# EAGLE design GPIO-Adapter_v11 (EAGLE 7.7.0)
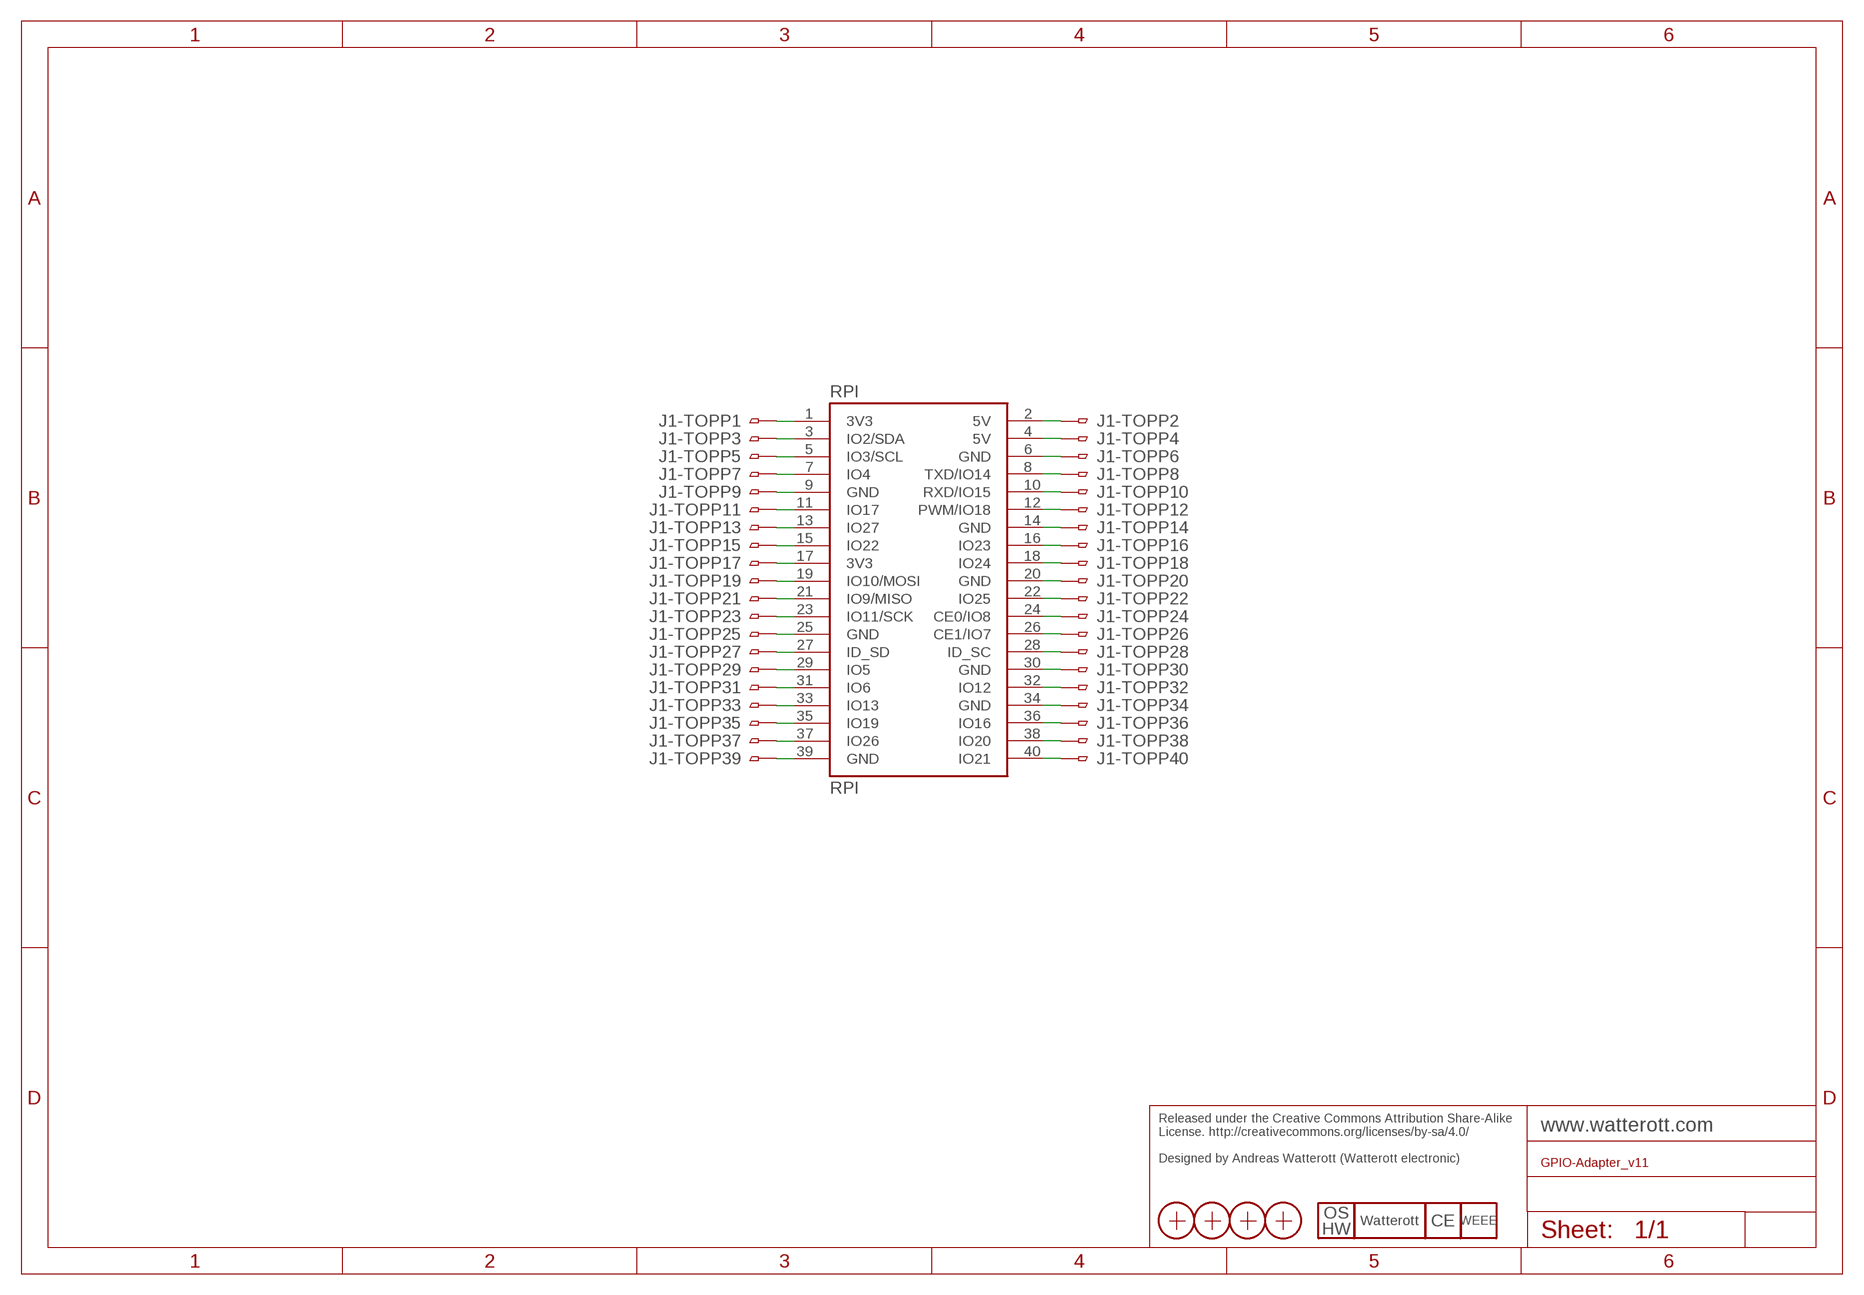
[diagram p0: schematic, sheet 1]

## Parts
J1-TOP  FPC40_PIN  [FPC40-0.5]
LOGO2  LOGO_OSHW-4  [OSHW_4MM]
LOGO3  LOGO_SPARK-4  [SPARK_4MM]
LOGO4  LOGO_CE-2  [CE_2MM]
LOGO5  LOGO_WEEE-4  [WEEE_4MM]
RPI  RPI  RPI_B+-CONTOP  [RPI-B+_CON_TOP]
X1  PASSER  [PASSER]
X2  PASSER  [PASSER]
X3  PASSER  [PASSER]
X4  PASSER  [PASSER]

## Nets
1: J1-TOP.1 RPI.1(3V3)
2: J1-TOP.2 RPI.2(5V)
3: J1-TOP.3 RPI.3(IO2/SDA)
4: J1-TOP.4 RPI.4(5V)
5: J1-TOP.5 RPI.5(IO3/SCL)
6: J1-TOP.6 RPI.6(GND)
7: J1-TOP.7 RPI.7(IO4)
8: J1-TOP.8 RPI.8(TXD/IO14)
9: J1-TOP.9 RPI.9(GND)
10: J1-TOP.10 RPI.10(RXD/IO15)
11: J1-TOP.11 RPI.11(IO17)
12: J1-TOP.12 RPI.12(PWM/IO18)
13: J1-TOP.13 RPI.13(IO27)
14: J1-TOP.14 RPI.14(GND)
15: J1-TOP.15 RPI.15(IO22)
16: J1-TOP.16 RPI.16(IO23)
17: J1-TOP.17 RPI.17(3V3)
18: J1-TOP.18 RPI.18(IO24)
19: J1-TOP.19 RPI.19(IO10/MOSI)
20: J1-TOP.20 RPI.20(GND)
21: J1-TOP.21 RPI.21(IO9/MISO)
22: J1-TOP.22 RPI.22(IO25)
23: J1-TOP.23 RPI.23(IO11/SCK)
24: J1-TOP.24 RPI.24(CE0/IO8)
25: J1-TOP.25 RPI.25(GND)
26: J1-TOP.26 RPI.26(CE1/IO7)
27: J1-TOP.27 RPI.27(ID_SD)
28: J1-TOP.28 RPI.28(ID_SC)
29: J1-TOP.29 RPI.29(IO5)
30: J1-TOP.30 RPI.30(GND)
31: J1-TOP.31 RPI.31(IO6)
32: J1-TOP.32 RPI.32(IO12)
33: J1-TOP.33 RPI.33(IO13)
34: J1-TOP.34 RPI.34(GND)
35: J1-TOP.35 RPI.35(IO19)
36: J1-TOP.36 RPI.36(IO16)
37: J1-TOP.37 RPI.37(IO26)
38: J1-TOP.38 RPI.38(IO20)
39: J1-TOP.39 RPI.39(GND)
40: J1-TOP.40 RPI.40(IO21)

## Notes on the sheet
- Released under the Creative Commons Attribution Share-Alike 
  License. http://creativecommons.org/licenses/by-sa/4.0/
  
  Designed by Andreas Watterott (Watterott electronic)

## Library data of the parts
J1-TOP = we-con:FPC40_PIN: FPC/ZIF Connector FCI 62684-402100AHLF -> 40 Pins 0.5mm top contact FCI 62684-401100AHLF -> 40 Pins 0.5mm bottom contact; DIGIKEY_BOT: 62684-401100AHLF-ND; DIGIKEY_TOP: 62684-402100AHLF-ND
LOGO2 = we-symbol:LOGO_OSHW: Open-Source-Hardware Logo
LOGO3 = we-symbol:LOGO_SPARK: Watterott electronic Logo
LOGO4 = we-symbol:LOGO_CE: CE Logo
LOGO5 = we-symbol:LOGO_WEEE: WEEE Logo
RPI = we-board:RPI_B+: Raspberry Pi 1 B+ / Pi 2 / Pi 3 / Pi Zero
X1-X4 = SMD:PASSER

## Board
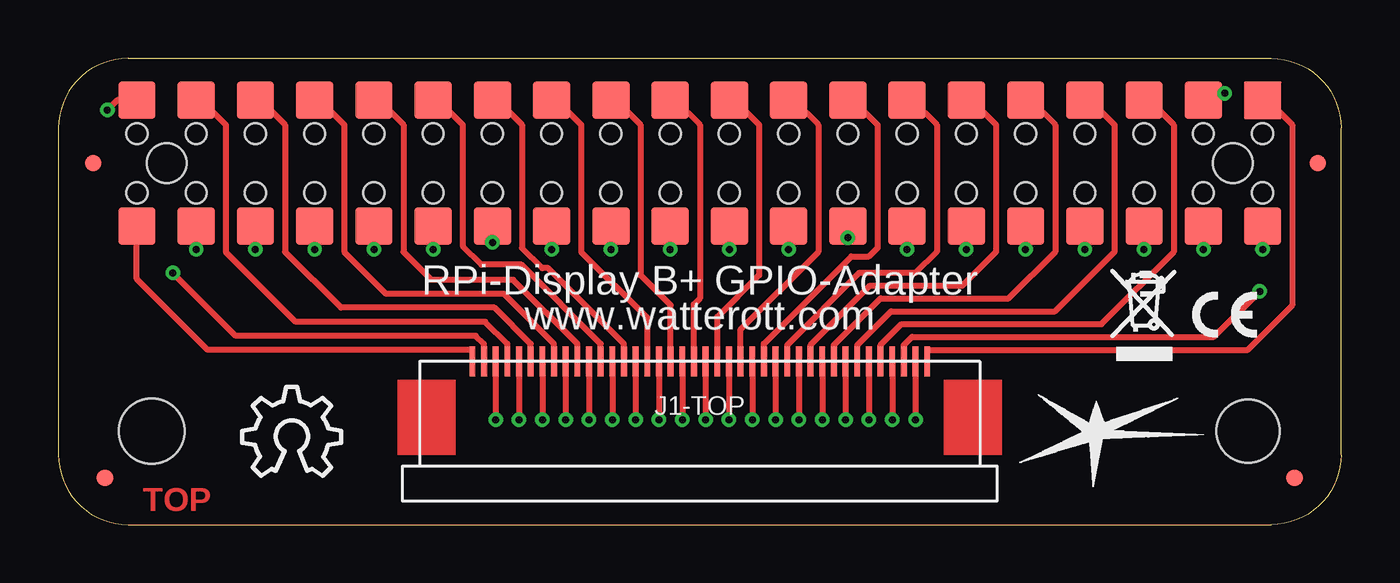
[diagram p1: board, top side]
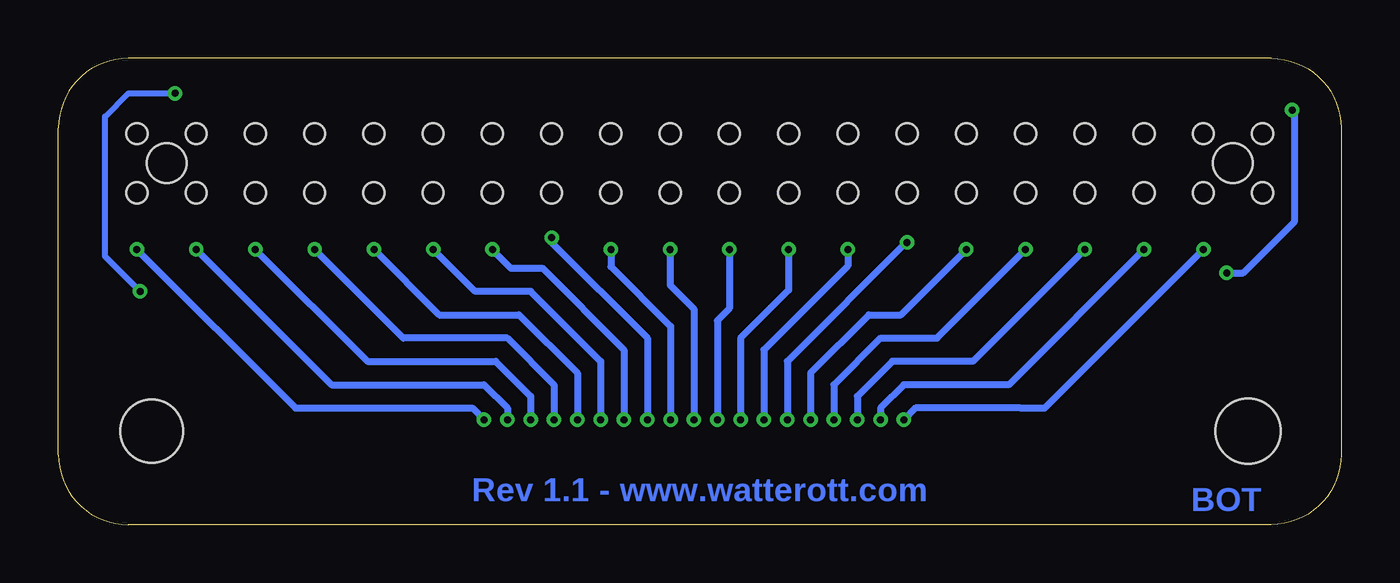
[diagram p2: board, bottom side, seen from below]

Size 55 x 20 mm. Coordinates in mm from the lower left corner, seen from the top.
Outline: 3,0 52,0 arc90 55,3 55,17 arc90 52,20 3,20 arc90 0,17 0,3 arc90 3,0
Copper layers (1*16): Top 0.035mm / dielectric 1.5mm / Bottom 0.035mm
Design rules "we-dru-2-layer *": minimum track width 0.18mm, minimum drill 0.3mm, track to track 0.18mm, track to pad 0.18mm, pad to pad 0.18mm, via to via 0.18mm, smd to smd 0mil, copper to edge 0.4mm, drill to drill 0.2mm, minimum pad ring 0.18mm, minimum via ring 0.16mm, stop-mask expansion 0.1mm, vias tented up to drill 0.5mm, thermal gap 0.25mm
Holes 2.7 mm at 51,4
Holes 2.8 mm at 4,4

### Footprints (pad centres in the part's own frame; a part is rotated, then mirrored left to right if it is on the bottom)
FPC40-0.5 = smd 1.27 x 0.279: 1 0,9.75; 2 0,9.25; 3 0,8.75; 4 0,8.25; 5 0,7.75; 6 0,7.25; 7 0,6.75; 8 0,6.25; 9 0,5.75; 10 0,5.25; 11 0,4.75; 12 0,4.25; 13 0,3.75; 14 0,3.25; 15 0,2.75; 16 0,2.25; 17 0,1.75; 18 0,1.25; 19 0,0.75; 20 0,0.25; 21 0,-0.25; 22 0,-0.75; 23 0,-1.25; 24 0,-1.75; 25 0,-2.25; 26 0,-2.75; 27 0,-3.25; 28 0,-3.75; 29 0,-4.25; 30 0,-4.75; 31 0,-5.25; 32 0,-5.75; 33 0,-6.25; 34 0,-6.75; 35 0,-7.25; 36 0,-7.75; 37 0,-8.25; 38 0,-8.75; 39 0,-9.25; 40 0,-9.75
RPI-B+_CON_TOP = smd 1.6 x 1.6: 1 -24.13,-2.7; 2 -24.13,2.7; 3 -21.59,-2.7; 4 -21.59,2.7; 5 -19.05,-2.7; 6 -19.05,2.7; 7 -16.51,-2.7; 8 -16.51,2.7; 9 -13.97,-2.7; 10 -13.97,2.7; 11 -11.43,-2.7; 12 -11.43,2.7; 13 -8.89,-2.7; 14 -8.89,2.7; 15 -6.35,-2.7; 16 -6.35,2.7; 17 -3.81,-2.7; 18 -3.81,2.7; 19 -1.27,-2.7; 20 -1.27,2.7; 21 1.27,-2.7; 22 1.27,2.7; 23 3.81,-2.7; 24 3.81,2.7; 25 6.35,-2.7; 26 6.35,2.7; 27 8.89,-2.7; 28 8.89,2.7; 29 11.43,-2.7; 30 11.43,2.7; 31 13.97,-2.7; 32 13.97,2.7; 33 16.51,-2.7; 34 16.51,2.7; 35 19.05,-2.7; 36 19.05,2.7; 37 21.59,-2.7; 38 21.59,2.7; 39 24.13,-2.7; 40 24.13,2.7 | hole 0.9: 24.13,1.27; 21.59,1.27; 19.05,1.27; 16.51,1.27; 13.97,1.27; 11.43,1.27; 8.89,1.27; 6.35,1.27; 3.81,1.27; 1.27,1.27; -1.27,1.27; -3.81,1.27; -6.35,1.27; -8.89,1.27; -11.43,1.27; -13.97,1.27; -16.51,1.27; -19.05,1.27; -21.59,1.27; -24.13,1.27; -24.13,-1.27; -21.59,-1.27; -19.05,-1.27; -16.51,-1.27; -13.97,-1.27; -11.43,-1.27; -8.89,-1.27; -6.35,-1.27; -3.81,-1.27; -1.27,-1.27; 1.27,-1.27; 3.81,-1.27; 6.35,-1.27; 8.89,-1.27; 11.43,-1.27; 13.97,-1.27; 16.51,-1.27; 19.05,-1.27; 21.59,-1.27; 24.13,-1.27 | hole 1.7: -22.86,0; 22.86,0
PASSER = smd 0.7 x 0.7: X 0,0

### Placement (x,y rotation side)
J1-TOP  27.5,7 270 top
LOGO2  10,4 0 top
LOGO3  44.5,4 0 top
LOGO4  50,9 0 top
LOGO5  46.5,9 0 top
RPI  27.5,15.5 180 top
X1  2,2 0 top
X2  1.5,15.5 0 top
X3  54,15.5 0 top
X4  53,2 0 top

### Tracks (layer width: path | path; a pad name or v marks a point on that pad's centre or on a via)
1
  Top 0.254: J1-TOP.1 37.25,7.5 51,7.5 52.9,9.4 52.9,17.14 51.84,18.2 RPI.1
2  (via drill 0.3)
  Top 0.254: J1-TOP.2 v36.75,4.5 | RPI.2 v51.63,11.8
  Bottom 0.305: v36.75,4.5 37.25,5 44.83,5 v51.63,11.8
3  (via drill 0.3)
  Top 0.254: J1-TOP.3 36.25,7.7 36.6,8.05 49.55,8.05 v51.5,10 | v50,18.5 49.39,18.5 RPI.3
  Bottom 0.254: v51.5,10 53,11.5 53,17.5 52,18.5 v50,18.5
4  (via drill 0.3)
  Top 0.254: J1-TOP.4 v35.75,4.5 | RPI.4 v49.09,11.8
  Bottom 0.305: v35.75,4.5 35.75,5 36.75,6 43.29,6 v49.09,11.8
5
  Top 0.254: J1-TOP.5 35.25,7.7 36.15,8.6 44.72,8.6 47.82,11.7 47.82,17.14 46.77,18.2 RPI.5
6  (via drill 0.3)
  Top 0.254: J1-TOP.6 v34.75,4.5 | RPI.6 v46.55,11.8
  Bottom 0.305: v34.75,4.5 34.75,5.5 36.25,7 41.75,7 v46.55,11.8
7
  Top 0.254: J1-TOP.7 34.25,7.7 35.7,9.15 42.73,9.15 45.28,11.7 45.28,17.14 44.23,18.2 RPI.7
8  (via drill 0.3)
  Top 0.254: J1-TOP.8 v33.75,4.5 | RPI.8 v44.01,11.8
  Bottom 0.305: v33.75,4.5 33.75,6 35.75,8 40.21,8 v44.01,11.8
9
  Top 0.254: J1-TOP.9 33.25,7.7 35.25,9.7 40.74,9.7 42.74,11.7 42.74,17.14 41.69,18.2 RPI.9
10  (via drill 0.3)
  Top 0.254: J1-TOP.10 v32.75,4.5 | RPI.10 v41.47,11.8
  Bottom 0.305: v32.75,4.5 32.75,6.5 35.25,9 38.67,9 v41.47,11.8
11
  Top 0.254: J1-TOP.11 32.25,7.7 34.8,10.25 38.75,10.25 40.2,11.7 40.2,17.14 39.14,18.2 RPI.11
12  (via drill 0.3)
  Top 0.254: J1-TOP.12 v31.75,4.5 | RPI.12 v38.93,11.8
  Bottom 0.305: v31.75,4.5 J1-TOP.12 34.75,10 37.13,10 v38.93,11.8
13
  Top 0.254: J1-TOP.13 31.25,7.7 34.35,10.8 36.76,10.8 37.66,11.7 37.66,17.14 36.61,18.2 RPI.13
14  (via drill 0.3)
  Top 0.254: J1-TOP.14 v30.75,4.5 | RPI.14 v36.39,11.8
  Bottom 0.254: v36.4,11.8 v36.39,11.8
  Bottom 0.305: v30.75,4.5 30.75,7.5 34.25,11 35.6,11 v36.4,11.8
15
  Top 0.254: J1-TOP.15 30.25,7.75 34,11.5 34.75,11.5 35.12,11.87 35.12,17.14 34.06,18.2 RPI.15
16  (via drill 0.3)
  Top 0.254: J1-TOP.16 v29.75,4.5 | RPI.16 v33.85,12.3
  Bottom 0.305: v29.75,4.5 29.75,8 33.85,12.1 v33.85,12.3
17
  Top 0.254: J1-TOP.17 29.25,8.37 32.58,11.7 32.58,17.14 31.52,18.2 RPI.17
18  (via drill 0.3)
  Top 0.254: J1-TOP.18 v28.75,4.5 | RPI.18 v31.31,11.8
  Bottom 0.305: v28.75,4.5 28.75,8.5 31.31,11.06 v31.31,11.8
19
  Top 0.254: J1-TOP.19 28.25,8.91 30.04,10.7 30.04,17.14 28.98,18.2 RPI.19
20  (via drill 0.3)
  Top 0.254: J1-TOP.20 v27.75,4.5 | RPI.20 v28.77,11.8
  Bottom 0.305: v27.75,4.5 27.75,9.25 28.77,10.27 v28.77,11.8
21
  Top 0.254: J1-TOP.21 27.25,9.45 27.5,9.7 27.5,17.14 26.45,18.2 RPI.21
22  (via drill 0.3)
  Top 0.254: J1-TOP.22 v26.75,4.5 | RPI.22 v26.23,11.8
  Bottom 0.305: v26.75,4.5 26.75,8.75 26.23,9.27 v26.23,11.8
23
  Top 0.254: J1-TOP.23 26.25,9.41 24.96,10.7 24.96,17.14 23.91,18.2 RPI.23
24  (via drill 0.3)
  Top 0.254: J1-TOP.24 v25.75,4.5 | RPI.24 v23.69,11.8
  Bottom 0.305: v25.75,4.5 25.75,8 23.69,10.06 v23.69,11.8
25
  Top 0.254: J1-TOP.25 25.25,8.87 22.42,11.7 22.42,17.14 21.37,18.2 RPI.25
26  (via drill 0.3)
  Top 0.254: J1-TOP.26 v24.75,4.5 | RPI.26 v21.15,11.8
  Bottom 0.305: v24.75,4.5 24.75,7.5 21.15,11.1 v21.15,11.8
27
  Top 0.254: RPI.27 18.82,18.2 19.88,17.14 19.88,11.87 20.75,11 21,11 24.25,7.75 J1-TOP.27
28  (via drill 0.3)
  Top 0.254: J1-TOP.28 v23.75,4.5 | RPI.28 v18.61,12.1
  Bottom 0.305: v23.75,4.5 J1-TOP.28 18.61,12.14 v18.61,12.1
29
  Top 0.254: J1-TOP.29 23.25,7.75 19.85,11.15 18.14,11.15 17.34,11.95 17.34,17.14 16.29,18.2 RPI.29
30  (via drill 0.3)
  Top 0.254: J1-TOP.30 v22.75,4.5 | RPI.30 v16.07,11.8
  Bottom 0.305: v22.75,4.5 22.75,6.5 20.25,9 18.87,9 v16.07,11.8
31
  Top 0.254: J1-TOP.31 22.25,7.75 19.5,10.5 16,10.5 14.8,11.7 14.8,17.14 13.74,18.2 RPI.31
32  (via drill 0.3)
  Top 0.254: J1-TOP.32 v21.75,4.5 | RPI.32 v13.53,11.8
  Bottom 0.305: v21.75,4.5 21.75,6 19.75,8 17.33,8 v13.53,11.8
33
  Top 0.254: J1-TOP.33 21.25,7.75 19.1,9.9 14.06,9.9 12.26,11.7 12.26,17.14 11.2,18.2 RPI.33
34  (via drill 0.3)
  Top 0.254: J1-TOP.34 v20.75,4.5 | RPI.34 v10.99,11.8
  Bottom 0.305: v20.75,4.5 20.75,5.5 19.25,7 15.79,7 v10.99,11.8
35
  Top 0.254: J1-TOP.35 20.25,7.75 18.7,9.3 12.12,9.3 9.72,11.7 9.72,17.14 8.66,18.2 RPI.35
36  (via drill 0.3)
  Top 0.254: J1-TOP.36 v19.75,4.5 | RPI.36 v8.45,11.8
  Bottom 0.305: v19.75,4.5 19.75,5 18.75,6 14.25,6 v8.45,11.8
37
  Top 0.254: J1-TOP.37 19.25,7.75 18.3,8.7 10.18,8.7 7.18,11.7 7.18,17.14 6.12,18.2 RPI.37
38  (via drill 0.3)
  Top 0.254: J1-TOP.38 v18.75,4.5 | RPI.38 v5.91,11.8
  Bottom 0.305: v18.75,4.5 18.25,5 13.75,5 12.71,5 v5.91,11.8
39  (via drill 0.3)
  Top 0.254: J1-TOP.39 18.25,7.75 17.9,8.1 7.61,8.1 v4.91,10.79 | RPI.39 2.52,18.2 v2.1,17.78
  Bottom 0.305: v4.91,10.79 4.2,10.79 2,13 2,17.68 v2.1,17.78
40
  Top 0.254: J1-TOP.40 17.75,7.5 6.4,7.5 3.37,10.53 RPI.40

### Text on the board
Top: TOP
Bottom: BOT | Rev 1.1 - www.watterott.com
tPlace: RPi-Display B+ GPIO-Adapter | www.watterott.com
Reference: Silkscreen: 21 tPlace